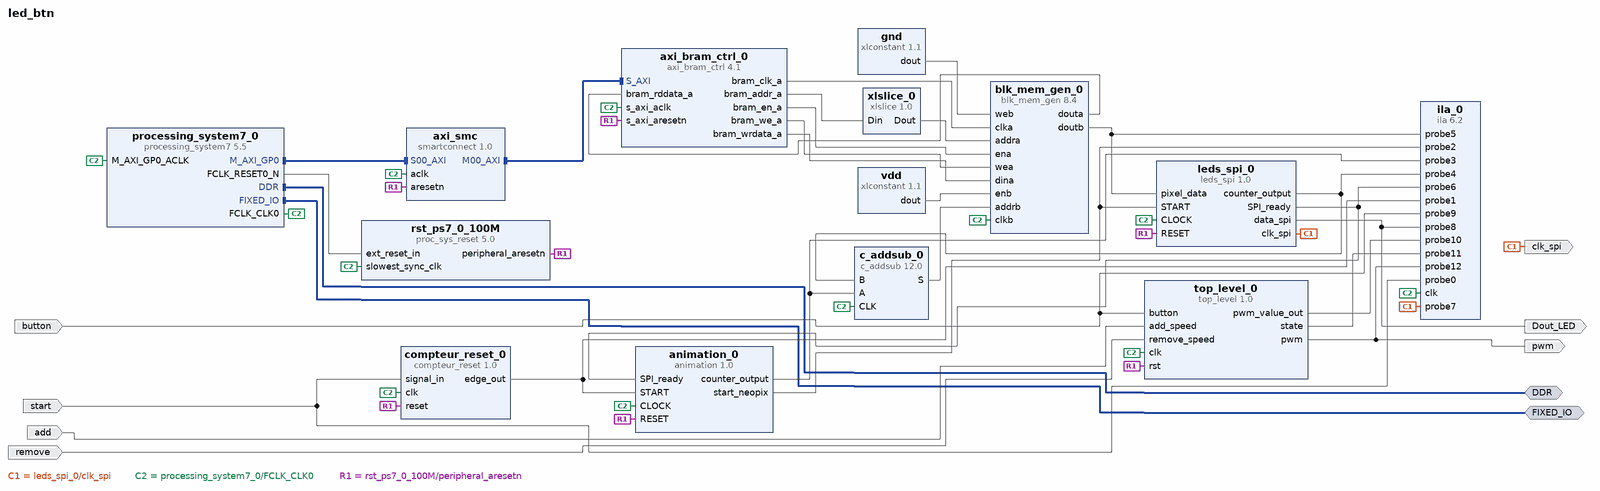
[diagram p0: block diagram of the top level]
# Vivado block design led_btn, xc7z020clg400-1, Vivado 2023.1
create_bd_design led_btn

create_bd_intf_port -mode Master -vlnv xilinx.com:interface:ddrx_rtl:1.0 DDR
create_bd_intf_port -mode Master -vlnv xilinx.com:display_processing_system7:fixedio_rtl:1.0 FIXED_IO
create_bd_port -dir O -type data Dout_LED
create_bd_port -dir I start
create_bd_port -dir O -type clk clk_spi
create_bd_port -dir I button
create_bd_port -dir O pwm
create_bd_port -dir I add
create_bd_port -dir I remove

create_bd_cell -type ip -vlnv xilinx.com:ip:processing_system7:5.5 processing_system7_0
set_property -dict [list \
  CONFIG.PCW_APU_PERIPHERAL_FREQMHZ 650 \
  CONFIG.PCW_CRYSTAL_PERIPHERAL_FREQMHZ 50 \
  CONFIG.PCW_ENET0_ENET0_IO {MIO 16 .. 27} \
  CONFIG.PCW_ENET0_GRP_MDIO_ENABLE 1 \
  CONFIG.PCW_ENET0_GRP_MDIO_IO {MIO 52 .. 53} \
  CONFIG.PCW_ENET0_PERIPHERAL_ENABLE 1 \
  CONFIG.PCW_ENET0_RESET_ENABLE 1 \
  CONFIG.PCW_ENET0_RESET_IO {MIO 9} \
  CONFIG.PCW_ENET_RESET_ENABLE 1 \
  CONFIG.PCW_ENET_RESET_SELECT {Share reset pin} \
  CONFIG.PCW_FPGA0_PERIPHERAL_FREQMHZ 100 \
  CONFIG.PCW_FPGA1_PERIPHERAL_FREQMHZ 50 \
  CONFIG.PCW_GPIO_MIO_GPIO_ENABLE 1 \
  CONFIG.PCW_GPIO_MIO_GPIO_IO MIO \
  CONFIG.PCW_I2C_RESET_ENABLE 1 \
  CONFIG.PCW_M_AXI_GP0_FREQMHZ 10 \
  CONFIG.PCW_PERIPHERAL_BOARD_PRESET part0 \
  CONFIG.PCW_PRESET_BANK1_VOLTAGE {LVCMOS 1.8V} \
  CONFIG.PCW_QSPI_GRP_FBCLK_ENABLE 1 \
  CONFIG.PCW_QSPI_GRP_FBCLK_IO {MIO 8} \
  CONFIG.PCW_QSPI_GRP_SINGLE_SS_ENABLE 1 \
  CONFIG.PCW_QSPI_GRP_SINGLE_SS_IO {MIO 1 .. 6} \
  CONFIG.PCW_QSPI_PERIPHERAL_ENABLE 1 \
  CONFIG.PCW_QSPI_QSPI_IO {MIO 1 .. 6} \
  CONFIG.PCW_SD0_GRP_CD_ENABLE 1 \
  CONFIG.PCW_SD0_GRP_CD_IO {MIO 47} \
  CONFIG.PCW_SD0_GRP_WP_ENABLE 0 \
  CONFIG.PCW_SD0_PERIPHERAL_ENABLE 1 \
  CONFIG.PCW_SD0_SD0_IO {MIO 40 .. 45} \
  CONFIG.PCW_SDIO_PERIPHERAL_FREQMHZ 50 \
  CONFIG.PCW_SINGLE_QSPI_DATA_MODE x4 \
  CONFIG.PCW_UART0_PERIPHERAL_ENABLE 1 \
  CONFIG.PCW_UART0_UART0_IO {MIO 14 .. 15} \
  CONFIG.PCW_UART1_PERIPHERAL_ENABLE 0 \
  CONFIG.PCW_UART_PERIPHERAL_FREQMHZ 100 \
  CONFIG.PCW_UIPARAM_DDR_BUS_WIDTH {16 Bit} \
  CONFIG.PCW_UIPARAM_DDR_FREQ_MHZ 525 \
  CONFIG.PCW_UIPARAM_DDR_PARTNO {MT41J256M16 RE-125} \
  CONFIG.PCW_USB0_PERIPHERAL_ENABLE 1 \
  CONFIG.PCW_USB0_RESET_ENABLE 1 \
  CONFIG.PCW_USB0_RESET_IO {MIO 46} \
  CONFIG.PCW_USB0_USB0_IO {MIO 28 .. 39} \
  CONFIG.PCW_USB_RESET_ENABLE 1 \
  CONFIG.PCW_USB_RESET_SELECT {Share reset pin} \
] [get_bd_cells processing_system7_0]
# 486 more settings of processing_system7_0 are not shown: defaults, MIO pin electricals, DDR timing, and values the tool derives
create_bd_cell -type ip -vlnv xilinx.com:ip:proc_sys_reset:5.0 rst_ps7_0_100M
create_bd_cell -type ip -vlnv xilinx.com:ip:xlslice:1.0 xlslice_0
set_property -dict {CONFIG.DIN_FROM 17 CONFIG.DIN_TO 2 CONFIG.DIN_WIDTH 18} [get_bd_cells xlslice_0]
create_bd_cell -type ip -vlnv xilinx.com:user:animation:1.0 animation_0
set_property -dict {CONFIG.count_num 51840 CONFIG.count_width 16} [get_bd_cells animation_0]
create_bd_cell -type ip -vlnv xilinx.com:user:leds_spi:1.0 leds_spi_0
set_property -dict {CONFIG.count_num 144 CONFIG.freq_div 10} [get_bd_cells leds_spi_0]
create_bd_cell -type ip -vlnv xilinx.com:user:compteur_reset:1.0 compteur_reset_0
create_bd_cell -type ip -vlnv xilinx.com:ip:axi_bram_ctrl:4.1 axi_bram_ctrl_0
set_property -dict {CONFIG.PROTOCOL AXI4LITE CONFIG.SINGLE_PORT_BRAM 1} [get_bd_cells axi_bram_ctrl_0]
create_bd_cell -type ip -vlnv xilinx.com:ip:smartconnect:1.0 axi_smc
set_property -dict {CONFIG.NUM_SI 1} [get_bd_cells axi_smc]
create_bd_cell -type ip -vlnv xilinx.com:ip:blk_mem_gen:8.4 blk_mem_gen_0
set_property -dict [list \
  CONFIG.Assume_Synchronous_Clk false \
  CONFIG.Disable_Collision_Warnings true \
  CONFIG.Enable_32bit_Address false \
  CONFIG.Enable_A Use_ENA_Pin \
  CONFIG.Enable_B Use_ENB_Pin \
  CONFIG.Memory_Type True_Dual_Port_RAM \
  CONFIG.Port_B_Clock 100 \
  CONFIG.Port_B_Enable_Rate 100 \
  CONFIG.Port_B_Write_Rate 50 \
  CONFIG.Register_PortA_Output_of_Memory_Primitives true \
  CONFIG.Register_PortB_Output_of_Memory_Primitives true \
  CONFIG.Use_Byte_Write_Enable false \
  CONFIG.Use_RSTA_Pin false \
  CONFIG.Write_Depth_A 65536 \
  CONFIG.Write_Width_A 32 \
  CONFIG.use_bram_block Stand_Alone \
] [get_bd_cells blk_mem_gen_0]
create_bd_cell -type ip -vlnv xilinx.com:ip:c_addsub:12.0 c_addsub_0
set_property -dict [list \
  CONFIG.A_Type Unsigned \
  CONFIG.A_Width 16 \
  CONFIG.B_Type Unsigned \
  CONFIG.B_Value 00000000 \
  CONFIG.B_Width 8 \
  CONFIG.CE false \
  CONFIG.Latency 1 \
  CONFIG.Out_Width 16 \
] [get_bd_cells c_addsub_0]
create_bd_cell -type ip -vlnv xilinx.com:ip:xlconstant:1.1 vdd
set_property -dict {CONFIG.CONST_VAL 1} [get_bd_cells vdd]
create_bd_cell -type ip -vlnv xilinx.com:ip:ila:6.2 ila_0
set_property -dict [list \
  CONFIG.ALL_PROBE_SAME_MU_CNT 8 \
  CONFIG.C_DATA_DEPTH 32768 \
  CONFIG.C_MONITOR_TYPE Native \
  CONFIG.C_NUM_OF_PROBES 13 \
  CONFIG.C_PROBE0_MU_CNT 8 \
  CONFIG.C_PROBE10_MU_CNT 8 \
  CONFIG.C_PROBE11_MU_CNT 8 \
  CONFIG.C_PROBE12_MU_CNT 8 \
  CONFIG.C_PROBE13_MU_CNT 8 \
  CONFIG.C_PROBE14_MU_CNT 8 \
  CONFIG.C_PROBE15_MU_CNT 8 \
  CONFIG.C_PROBE16_MU_CNT 8 \
  CONFIG.C_PROBE17_MU_CNT 8 \
  CONFIG.C_PROBE18_MU_CNT 8 \
  CONFIG.C_PROBE19_MU_CNT 8 \
  CONFIG.C_PROBE1_MU_CNT 8 \
  CONFIG.C_PROBE20_MU_CNT 8 \
  CONFIG.C_PROBE21_MU_CNT 8 \
  CONFIG.C_PROBE22_MU_CNT 8 \
  CONFIG.C_PROBE23_MU_CNT 8 \
  CONFIG.C_PROBE24_MU_CNT 8 \
  CONFIG.C_PROBE25_MU_CNT 8 \
  CONFIG.C_PROBE26_MU_CNT 8 \
  CONFIG.C_PROBE27_MU_CNT 8 \
  CONFIG.C_PROBE28_MU_CNT 8 \
  CONFIG.C_PROBE29_MU_CNT 8 \
  CONFIG.C_PROBE2_MU_CNT 8 \
  CONFIG.C_PROBE30_MU_CNT 8 \
  CONFIG.C_PROBE31_MU_CNT 8 \
  CONFIG.C_PROBE32_MU_CNT 8 \
  CONFIG.C_PROBE33_MU_CNT 8 \
  CONFIG.C_PROBE34_MU_CNT 8 \
  CONFIG.C_PROBE35_MU_CNT 8 \
  CONFIG.C_PROBE36_MU_CNT 8 \
  CONFIG.C_PROBE37_MU_CNT 8 \
  CONFIG.C_PROBE38_MU_CNT 8 \
  CONFIG.C_PROBE39_MU_CNT 8 \
  CONFIG.C_PROBE3_MU_CNT 8 \
  CONFIG.C_PROBE40_MU_CNT 8 \
  CONFIG.C_PROBE41_MU_CNT 8 \
  CONFIG.C_PROBE42_MU_CNT 8 \
  CONFIG.C_PROBE43_MU_CNT 8 \
  CONFIG.C_PROBE4_MU_CNT 8 \
  CONFIG.C_PROBE5_MU_CNT 8 \
  CONFIG.C_PROBE6_MU_CNT 8 \
  CONFIG.C_PROBE7_MU_CNT 8 \
  CONFIG.C_PROBE8_MU_CNT 8 \
  CONFIG.C_PROBE9_MU_CNT 8 \
] [get_bd_cells ila_0]
create_bd_cell -type ip -vlnv xilinx.com:ip:xlconstant:1.1 gnd
set_property -dict {CONFIG.CONST_VAL 0} [get_bd_cells gnd]
create_bd_cell -type ip -vlnv xilinx.com:user:top_level:1.0 top_level_0

# ---- connections ----

connect_bd_intf_net [get_bd_intf_pins axi_smc/M00_AXI] [get_bd_intf_pins axi_bram_ctrl_0/S_AXI]
connect_bd_intf_net [get_bd_intf_ports DDR] [get_bd_intf_pins processing_system7_0/DDR]
connect_bd_intf_net [get_bd_intf_ports FIXED_IO] [get_bd_intf_pins processing_system7_0/FIXED_IO]
connect_bd_intf_net [get_bd_intf_pins processing_system7_0/M_AXI_GP0] [get_bd_intf_pins axi_smc/S00_AXI]
connect_bd_net [get_bd_ports button] [get_bd_pins ila_0/probe9] [get_bd_pins top_level_0/button]
connect_bd_net [get_bd_ports add] [get_bd_pins top_level_0/add_speed]
connect_bd_net [get_bd_pins animation_0/counter_output] [get_bd_pins c_addsub_0/A] [get_bd_pins ila_0/probe3]
connect_bd_net [get_bd_pins animation_0/start_neopix] [get_bd_pins leds_spi_0/START] [get_bd_pins ila_0/probe2]
connect_bd_net [get_bd_pins axi_bram_ctrl_0/bram_addr_a] [get_bd_pins xlslice_0/Din]
connect_bd_net [get_bd_pins axi_bram_ctrl_0/bram_clk_a] [get_bd_pins blk_mem_gen_0/clka]
connect_bd_net [get_bd_pins axi_bram_ctrl_0/bram_en_a] [get_bd_pins blk_mem_gen_0/ena]
connect_bd_net [get_bd_pins axi_bram_ctrl_0/bram_we_a] [get_bd_pins blk_mem_gen_0/wea]
connect_bd_net [get_bd_pins axi_bram_ctrl_0/bram_wrdata_a] [get_bd_pins blk_mem_gen_0/dina]
connect_bd_net [get_bd_pins blk_mem_gen_0/douta] [get_bd_pins axi_bram_ctrl_0/bram_rddata_a]
connect_bd_net [get_bd_pins blk_mem_gen_0/doutb] [get_bd_pins leds_spi_0/pixel_data] [get_bd_pins ila_0/probe5]
connect_bd_net -net compteur_reset_0_out_reg [get_bd_pins compteur_reset_0/edge_out] [get_bd_pins animation_0/START] [get_bd_pins ila_0/probe1]
connect_bd_net [get_bd_pins gnd/dout] [get_bd_pins blk_mem_gen_0/web]
connect_bd_net [get_bd_pins leds_spi_0/SPI_ready] [get_bd_pins animation_0/SPI_ready] [get_bd_pins ila_0/probe6]
connect_bd_net [get_bd_pins leds_spi_0/clk_spi] [get_bd_ports clk_spi] [get_bd_pins ila_0/probe7]
connect_bd_net -net leds_spi_0_counter_output [get_bd_pins c_addsub_0/S] [get_bd_pins blk_mem_gen_0/addrb]
connect_bd_net [get_bd_pins leds_spi_0/counter_output] [get_bd_pins c_addsub_0/B] [get_bd_pins ila_0/probe4]
connect_bd_net [get_bd_pins leds_spi_0/data_spi] [get_bd_ports Dout_LED] [get_bd_pins ila_0/probe8]
connect_bd_net [get_bd_pins processing_system7_0/FCLK_CLK0] \
  [get_bd_pins rst_ps7_0_100M/slowest_sync_clk] [get_bd_pins processing_system7_0/M_AXI_GP0_ACLK] \
  [get_bd_pins animation_0/CLOCK] [get_bd_pins leds_spi_0/CLOCK] [get_bd_pins compteur_reset_0/clk] \
  [get_bd_pins axi_bram_ctrl_0/s_axi_aclk] [get_bd_pins axi_smc/aclk] [get_bd_pins blk_mem_gen_0/clkb] \
  [get_bd_pins c_addsub_0/CLK] [get_bd_pins ila_0/clk] [get_bd_pins top_level_0/clk]
connect_bd_net [get_bd_pins processing_system7_0/FCLK_RESET0_N] [get_bd_pins rst_ps7_0_100M/ext_reset_in]
connect_bd_net [get_bd_ports remove] [get_bd_pins top_level_0/remove_speed]
connect_bd_net [get_bd_pins rst_ps7_0_100M/peripheral_aresetn] \
  [get_bd_pins animation_0/RESET] [get_bd_pins leds_spi_0/RESET] [get_bd_pins compteur_reset_0/reset] \
  [get_bd_pins axi_bram_ctrl_0/s_axi_aresetn] [get_bd_pins axi_smc/aresetn] [get_bd_pins top_level_0/rst]
connect_bd_net [get_bd_ports start] [get_bd_pins compteur_reset_0/signal_in] [get_bd_pins ila_0/probe0]
connect_bd_net [get_bd_pins top_level_0/pwm] [get_bd_ports pwm] [get_bd_pins ila_0/probe12]
connect_bd_net [get_bd_pins top_level_0/pwm_value_out] [get_bd_pins ila_0/probe10]
connect_bd_net [get_bd_pins top_level_0/state] [get_bd_pins ila_0/probe11]
connect_bd_net [get_bd_pins vdd/dout] [get_bd_pins blk_mem_gen_0/enb]
connect_bd_net [get_bd_pins xlslice_0/Dout] [get_bd_pins blk_mem_gen_0/addra]
set_property HDL_ATTRIBUTE.BMM_INFO_PROCESSOR {arm > led_btn axi_bram_ctrl_0} [get_bd_cells processing_system7_0]
set_property HDL_ATTRIBUTE.KEEP_HIERARCHY yes [get_bd_cells processing_system7_0]
set_property HDL_ATTRIBUTE.BMM_INFO_ADDRESS_SPACE {byte  0x40000000 32 > led_btn blk_mem_gen_0} [get_bd_cells axi_bram_ctrl_0]
set_property HDL_ATTRIBUTE.KEEP_HIERARCHY yes [get_bd_cells axi_bram_ctrl_0]

# ---- address map ----
assign_bd_address -offset 0x40000000 -range 64M -target_address_space [get_bd_addr_spaces processing_system7_0/Data] [get_bd_addr_segs axi_bram_ctrl_0/S_AXI/Mem0]

set_property USER_COMMENTS.comment_0 {Axi en byte addressable to word addrassable } [current_bd_design]

validate_bd_design
save_bd_design
